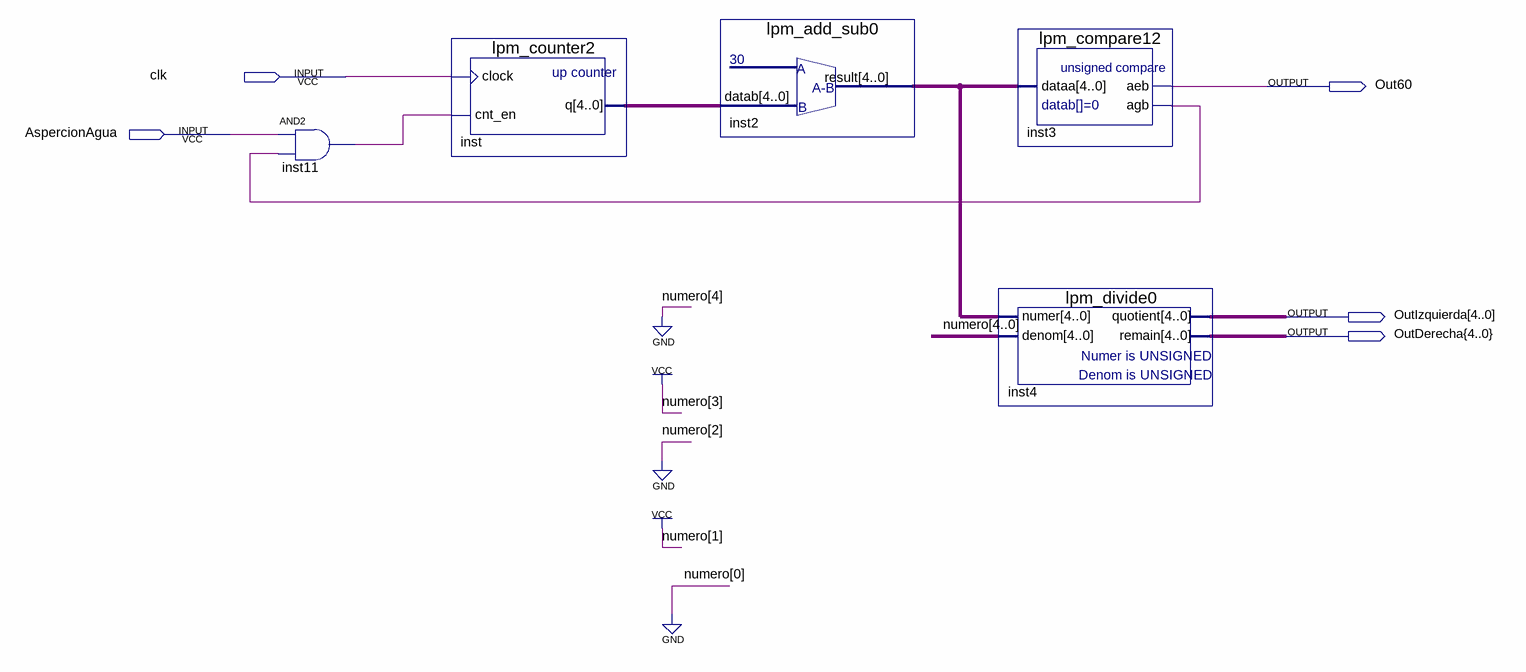
[diagram p0: schematic sheet]
// Quartus schematic Count30.bdf as structural Verilog: 5 symbols, 5 pins
module Count30 (
  input  clk,
  input  AspercionAgua,
  output Out60,
  output [4:0] OutIzquierda,
  output \OutDerecha{4..0} 
);

  wire inst3_agb, inst11_out;
  wire [4:0] inst2_result, inst4_remain, inst_q;

  and inst11 (inst11_out, AspercionAgua, inst3_agb);
  lpm_counter2 inst (.clock(clk), .cnt_en(inst11_out), .q(inst_q));
  lpm_add_sub0 inst2 (.datab(inst_q), .result(inst2_result));
  lpm_compare12 inst3 (.dataa(inst2_result), .aeb(Out60), .agb(inst3_agb));
  lpm_divide0 inst4 (.numer(inst2_result), .denom(5'b01010), .quotient(OutIzquierda), .remain(inst4_remain));
endmodule
